# EAGLE design Microcontroller_With_Power_Supply_Module_Project (EAGLE 9.6.2)
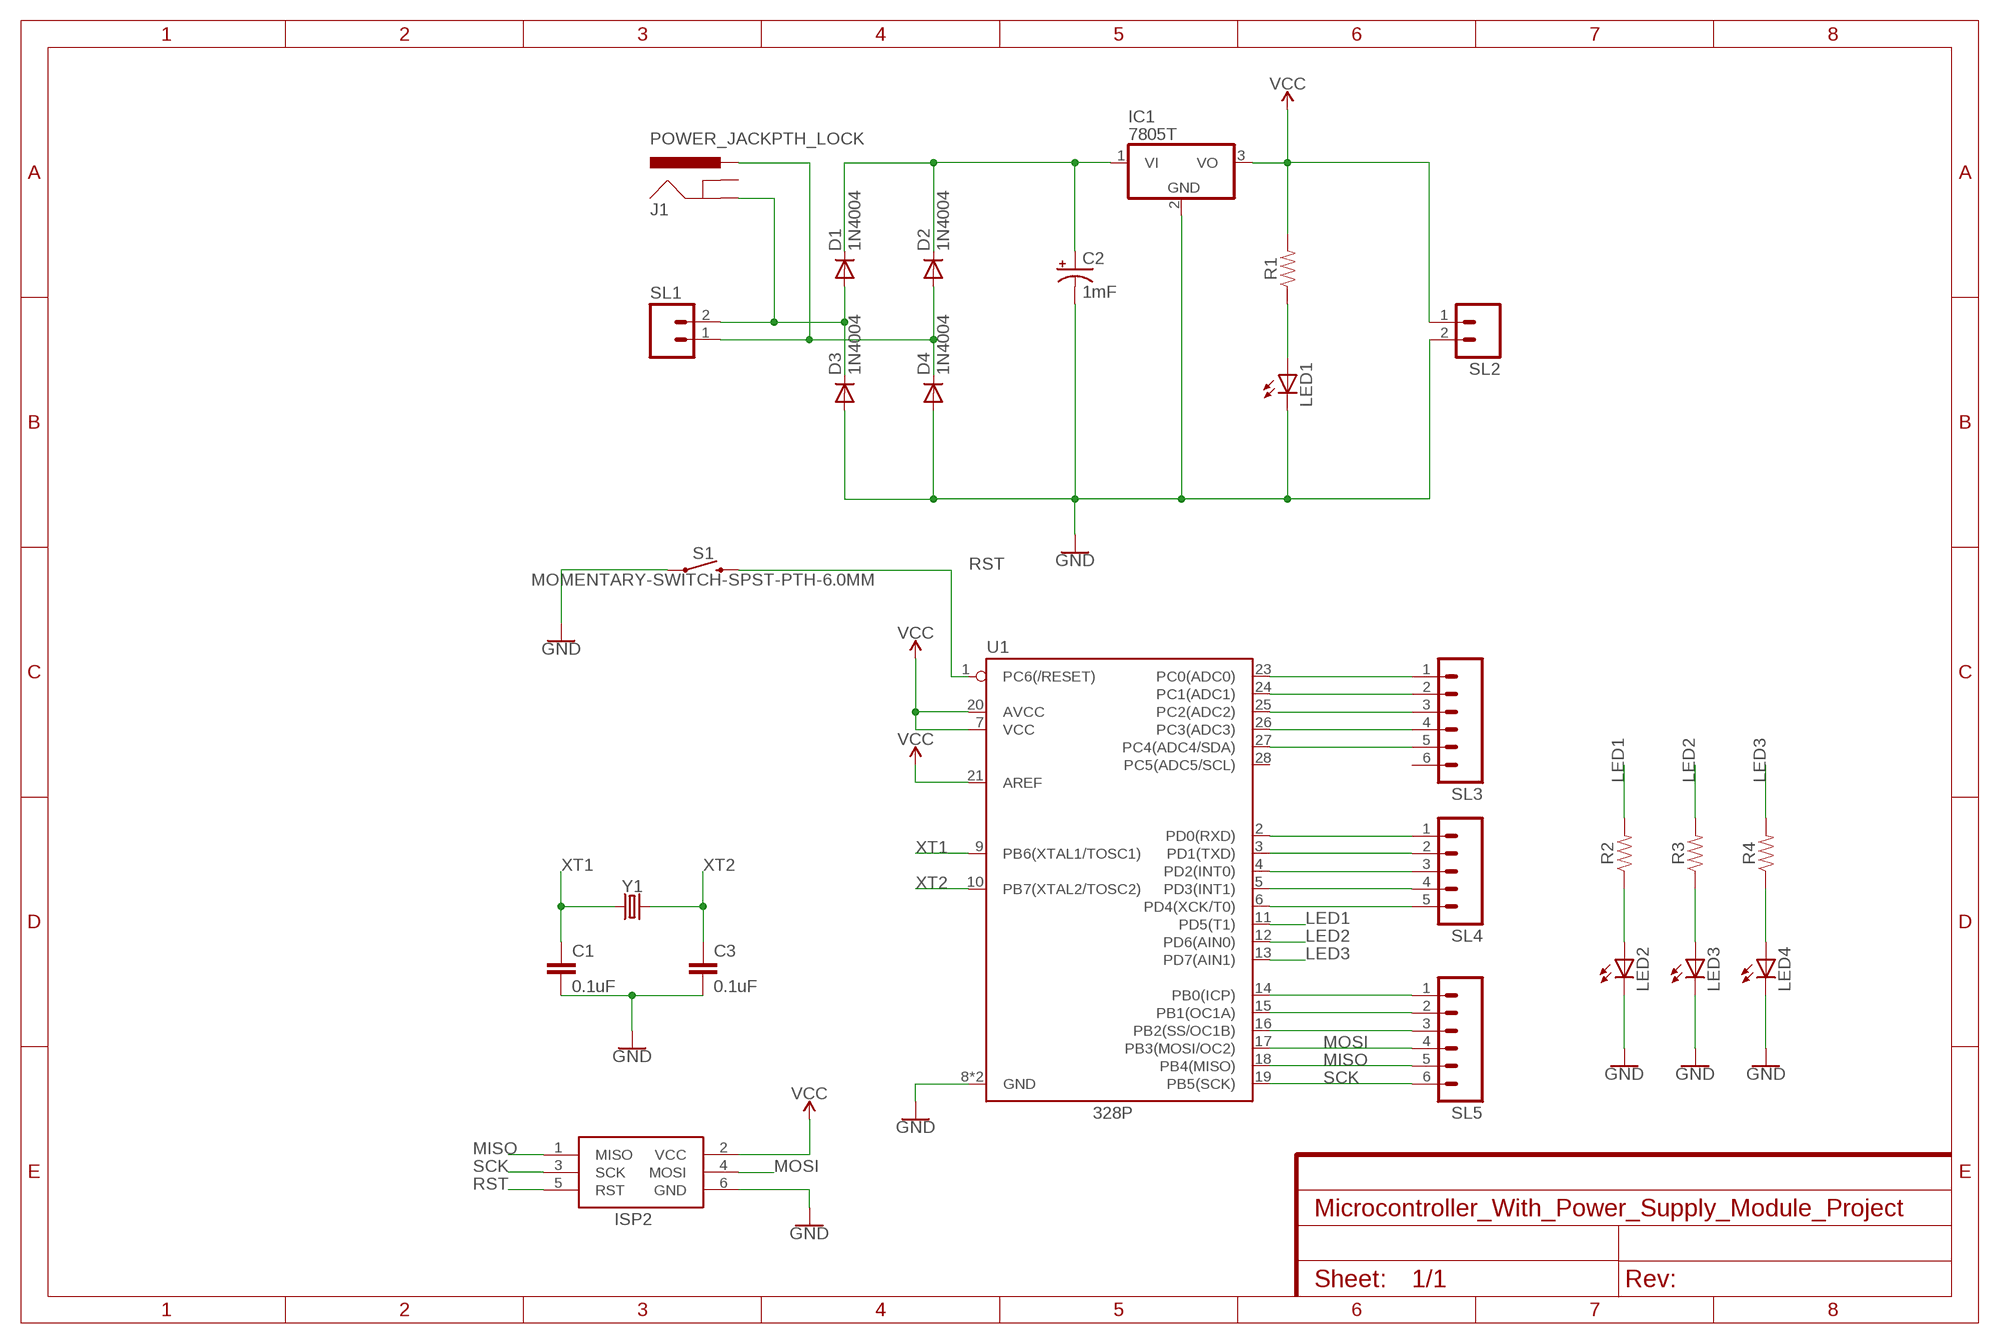
[diagram p0: schematic, sheet 1]

## Parts
C1  0.1uF  0.1UF-KIT-EZ-50V-20%  [CAP-PTH-SMALL-KIT]
C2  1mF  1000UF-RADIAL-5MM-25V-20%  [CPOL-RADIAL-5MM-10MM]
C3  0.1uF  0.1UF-KIT-EZ-50V-20%  [CAP-PTH-SMALL-KIT]
D1  1N4004  [DO41-10]
D2  1N4004  [DO41-10]
D3  1N4004  [DO41-10]
D4  1N4004  [DO41-10]
IC1  7805T  [TO220H]
ISP2  AVRISP-6  [AVRISP]
J1  POWER_JACKPTH_LOCK  [POWER_JACK_PTH_LOCK]
LED1  LED5MM  [LED5MM]
LED2  LED3MM  [LED3MM]
LED3  LED3MM  [LED3MM]
LED4  LED3MM  [LED3MM]
R1  RESISTORAXIAL-0.3  [AXIAL-0.3]
R2  RESISTORAXIAL-0.3  [AXIAL-0.3]
R3  RESISTORAXIAL-0.3  [AXIAL-0.3]
R4  RESISTORAXIAL-0.3  [AXIAL-0.3]
S1  MOMENTARY-SWITCH-SPST-PTH-6.0MM  [TACTILE_SWITCH_PTH_6.0MM]
SL1  M02  [02P]
SL2  M02  [02P]
SL3  M06  [06P]
SL4  M05  [05P]
SL5  M06  [06P]
U1  328P  ATMEGA328P_PDIP  [DIP28]
Y1  CRYSTALPTH-HC49US  [HC49US]

## Nets
GND: C1.2 C2.- C3.2 D3.A D4.A IC1.2(GND) ISP2.6(GND) LED1.K(C) LED2.K(C) LED3.K(C) LED4.K(C) S1.1 SL2.2 U1.8(GND) U1.22(GND)
LED1: R2.P$2 U1.11(PD5(T1))
LED2: R3.P$2 U1.12(PD6(AIN0))
LED3: R4.P$2 U1.13(PD7(AIN1))
MISO: ISP2.1(MISO) SL5.5 U1.18(PB4(MISO))
MOSI: ISP2.4(MOSI) SL5.4 U1.17(PB3(MOSI/OC2))
N$1: D1.A D3.C J1.GND SL1.2
N$2: D2.A D4.C J1.PWR SL1.1
N$3: C2.+ D1.C D2.C IC1.1(VI)
N$5: LED4.A R4.P$1
N$6: LED1.A R1.P$1
N$7: LED3.A R3.P$1
N$8: LED2.A R2.P$1
N$9: SL3.1 U1.23(PC0(ADC0))
N$10: SL3.2 U1.24(PC1(ADC1))
N$11: SL3.3 U1.25(PC2(ADC2))
N$12: SL3.4 U1.26(PC3(ADC3))
N$13: SL3.5 U1.27(PC4(ADC4/SDA))
N$14: SL4.1 U1.2(PD0(RXD))
N$15: SL4.2 U1.3(PD1(TXD))
N$16: SL4.3 U1.4(PD2(INT0))
N$17: SL4.4 U1.5(PD3(INT1))
N$18: SL4.5 U1.6(PD4(XCK/T0))
N$19: SL5.1 U1.14(PB0(ICP))
N$20: SL5.2 U1.15(PB1(OC1A))
N$21: SL5.3 U1.16(PB2(SS/OC1B))
RST: ISP2.5(RST) S1.3 U1.1(PC6(/RESET))
SCK: ISP2.3(SCK) SL5.6 U1.19(PB5(SCK))
VCC: IC1.3(VO) ISP2.2(VCC) R1.P$2 SL2.1 U1.7(VCC) U1.20(AVCC) U1.21(AREF)
XT1: C1.1 U1.9(PB6(XTAL1/TOSC1)) Y1.1
XT2: C3.1 U1.10(PB7(XTAL2/TOSC2)) Y1.2
Unconnected: J1.GNDBREAK SL3.6 U1.28(PC5(ADC5/SCL))

## Library data of the parts
C1 C3 = SparkFun-Capacitors:0.1UF: 0.1µF ceramic capacitors A capacitor is a passive two-terminal electrical component used to store electrical energy temporarily in an electric field.; PROD_ID: CAP-08370
C2 = SparkFun-Capacitors:1000UF: 1,000µF/1mF ceramic capacitors A capacitor is a passive two-terminal electrical component used to store electrical energy temporarily in an electric field. CAP-08070; PROD_ID: CAP-09538
D1-D4 = adafruit:1N4004: DIODE General purpose 1N400x type rectifier (With bigger pads) http://www.ladyada.net/library/pcb/eaglelibrary.html
IC1 = adafruit:78*: Positive VOLTAGE REGULATOR Added bigger pads to the TO-92 package
ISP2 = adafruit:AVRISP: AVR ISP HEADER Standard 6 pin header for AVR programming
J1 = SparkFun-Connectors:POWER_JACK: Power Jack Connector This is the standard 5.5mm barrel jack for power. The PTH is the most common, proven, reliable, footprint. The Slot footprint only works if the mill layer is transmitted to the PCB fab house so be warned. Here are the connectors we sell at SparkFun: DC Barrel Power Jack/Connector <https://www.sparkfun.com/products/119> (PRT-00119) DC Barrel Power Jack/Connector (SMD) <https://www.sparkfun.com/products/12748> (PRT-12748) DC Barrel Jack Adapter - Breadboard Compatible <https://www.sparkfun.com/products/10811> (PRT-10811) It is used on this SparkFun product (and many, many others): SparkFun RedBoard - Programmed with Arduino <https://www.sparkfun.com/products/12757> (DEV-12757) Also, if you need a mating power supply or connector, please check these out: Wall Adapter Power Supply - 9VDC 650mA <https://www.sparkfun.com/products/298> (TOL-00298) DC Barrel Jack Adapter - Male <https://www.sparkfun.com/products/10287> (PRT-10287); PROD_ID: CONN-08197; SF_ID: PRT-00119
LED1-LED4 = adafruit:LED: LED OSRAM: - CHIPLED LG R971, LG N971, LY N971, LG Q971, LY Q971, LO R971, LY R971 LH N974, LH R974 LS Q976, LO Q976, LY Q976 LO Q996 - Hyper CHIPLED LW Q18S LB Q993, LB Q99A, LB R99A - SideLED LS A670, LO A670, LY A670, LG A670, LP A670 LB A673, LV A673, LT A673, LW A673 LH A674 LY A675 LS A676, LA A676, LO A676, LY A676, LW A676 LS A679, LY A679, LG A679 - Hyper Micro SIDELED® LS Y876, LA Y876, LO Y876, LY Y876 LT Y87S - SmartLED LW L88C, LW L88S LB L89C, LB L89S, LG L890 LS L89K, LO L89K, LY L89K LS L896, LA L896, LO L896, LY L896 - TOPLED LS T670, LO T670, LY T670, LG T670, LP T670 LSG T670, LSP T670, LSY T670, LOP T670, LYG T670 LG T671, LOG T671, LSG T671 LB T673, LV T673, LT T673, LW T673 LH T674 LS T676, LA T676, LO T676, LY T676, LB T676, LH T676, LSB T676, LW T676 LB T67C, LV T67C, LT T67C, LS T67K, LO T67K, LY T67K, LW E67C LS E67B, LA E67B, LO E67B, LY E67B, LB E67C, LV E67C, LT E67C LW T67C LS T679, LY T679, LG T679 LS T770, LO T770, LY T770, LG T770, LP T770 LB T773, LV T773, LT T773, LW T773 LH T774 LS E675, LA E675, LY E675, LS T675 LS T776, LA T776, LO T776, LY T776, LB T776 LHGB T686 LT T68C, LB T68C - Hyper Mini TOPLED® LB M676 - Mini TOPLED Santana® LG M470 LS M47K, LO M47K, LY M47K Source: http://www.osram.convergy.de/
R1-R4 = SparkFun-Resistors:RESISTOR: Generic Resistor Package
S1 = SparkFun-Switches:MOMENTARY-SWITCH-SPST: Momentary Switch (Pushbutton) - SPST Normally-open (NO) SPST momentary switches (buttons, pushbuttons). Variants PTH-12MM - 12mm square, through-hole Momentary Pushbutton Switch - 12mm Square <https://www.sparkfun.com/products/9190> (COM-09190) PTH-6.0MM, PTH-6.0MM-KIT - 6.0mm square, through-hole Mini Pushbutton Switch <https://www.sparkfun.com/products/97> (COM-00097) KIT package intended for soldering kit's - only one side of pads' copper is exposed. PTH-RIGHT-ANGLE-KIT - Right-angle, through-hole Right Angle Tactile Button <https://www.sparkfun.com/products/10791> - Used on SparkFun BigTime Watch Kit <https://www.sparkfun.com/products/11734> SMD-12MM - 12mm square, surface-mount Tactile Button - SMD (12mm) <https://www.sparkfun.com/products/12993> (COM-12993) Used on SparkFun PicoBoard <https://www.sparkfun.com/products/11888> SMD-4.5MM - 4.5mm Square Trackball Switch Used on SparkFun Blackberry Trackballer Breakout <https://www.sparkfun.com/products/13169> SMD-4.6MMX2.8MM - 4.60mm x 2.80mm, surface mount Used on SparkFun Pro Micro - RP2040 <https://www.sparkfun.com/products/17717> SMD-5.2MM, SMD-5.2-REDUNDANT - 5.2mm square, surface-mount Mini Pushbutton Switch - SMD <https://www.sparkfun.com/products/8720> (COM-08720) Used on Arduino Pro Mini <https://www.sparkfun.com/products/11114> REDUNDANT package connects both switch circuits together SMD-6.0X3.5MM - 6.0 x 3.5mm, surface mount Momentary Reset Switch SMD <https://www.sparkfun.com/products/8229> (COM-08229) SMD-6.2MM-TALL - 6.2mm square, surface mount Tactile Button - SMD (6mm) <https://www.sparkfun.com/products/12992> Used on SparkFun Digital Sandbox <https://www.sparkfun.com/products/12651> SMD-RIGHT-ANGLE - Right-angle, surface mount Used on SparkFun Block for Intel® Edison - Arduino <https://www.sparkfun.com/products/13036>; PROD_ID: SWCH-08441; SF_SKU: COM-00097
SL1 SL2 = con-amp-quick:M02: AMP QUICK CONNECTOR; OC_FARNELL: unknown; OC_NEWARK: unknown
SL3 SL5 = con-amp-quick:M06: AMP QUICK CONNECTOR; OC_FARNELL: unknown; OC_NEWARK: unknown
SL4 = con-amp-quick:M05: AMP QUICK CONNECTOR; OC_FARNELL: unknown; OC_NEWARK: unknown
U1 = SparkFun-IC-Microcontroller:ATMEGA328P_PDIP: Atmel 328P Through hole ATMEGA328P uC used in the Arduino 32kb flash, 1k EEPROM, 2k SRAM Datasheet <http://www.sparkfun.com/datasheets/Components/SMD/ATMega328.pdf> SparkFun Products Storefront component: AVR 28 Pin 20MHz 32K 6A/D - ATMega328P <https://www.sparkfun.com/products/9061> (COM-09061) SparkFun Simon Says - Through-Hole Soldering Kit <https://www.sparkfun.com/products/10547> (KIT-10547) SparkFun Learn to Solder - Simon Says <https://www.sparkfun.com/products/13708> (KIT-13708) SparkFun BigTime Watch Kit <https://www.sparkfun.com/products/11734> (KIT-11734) SparkFun ClockIt <https://www.sparkfun.com/products/10930> (KIT-10930) SparkFun Serial Enabled LCD Kit <https://www.sparkfun.com/products/10097> (LCD-10097) SparkFun Simon Tilts - Through Hole Soldering Kit <https://www.sparkfun.com/products/12634> (KIT-12634) SparkFun Frequency Counter Kit <https://www.sparkfun.com/products/10140> (KIT-10140) FabFM Radio Kit <https://www.sparkfun.com/products/11043> (KIT-11043) SparkFun Binary Blaster Kit <https://www.sparkfun.com/products/12037> (KIT-12037) SparkFun Metro-Gnome <https://www.sparkfun.com/products/9236> (KIT-09236) ATmega328 with Arduino Optiboot (Uno) <https://www.sparkfun.com/products/10524> (DEV-10524); PROD_ID: IC-09136
Y1 = SparkFun-Clocks:CRYSTAL: Crystals (Generic) These are passive quartz crystals, which can be used as a clock source for a microcontroller. Crystal's are two-terminal devices. They require external "load" capacitors to generate an oscillating signal.

## Board
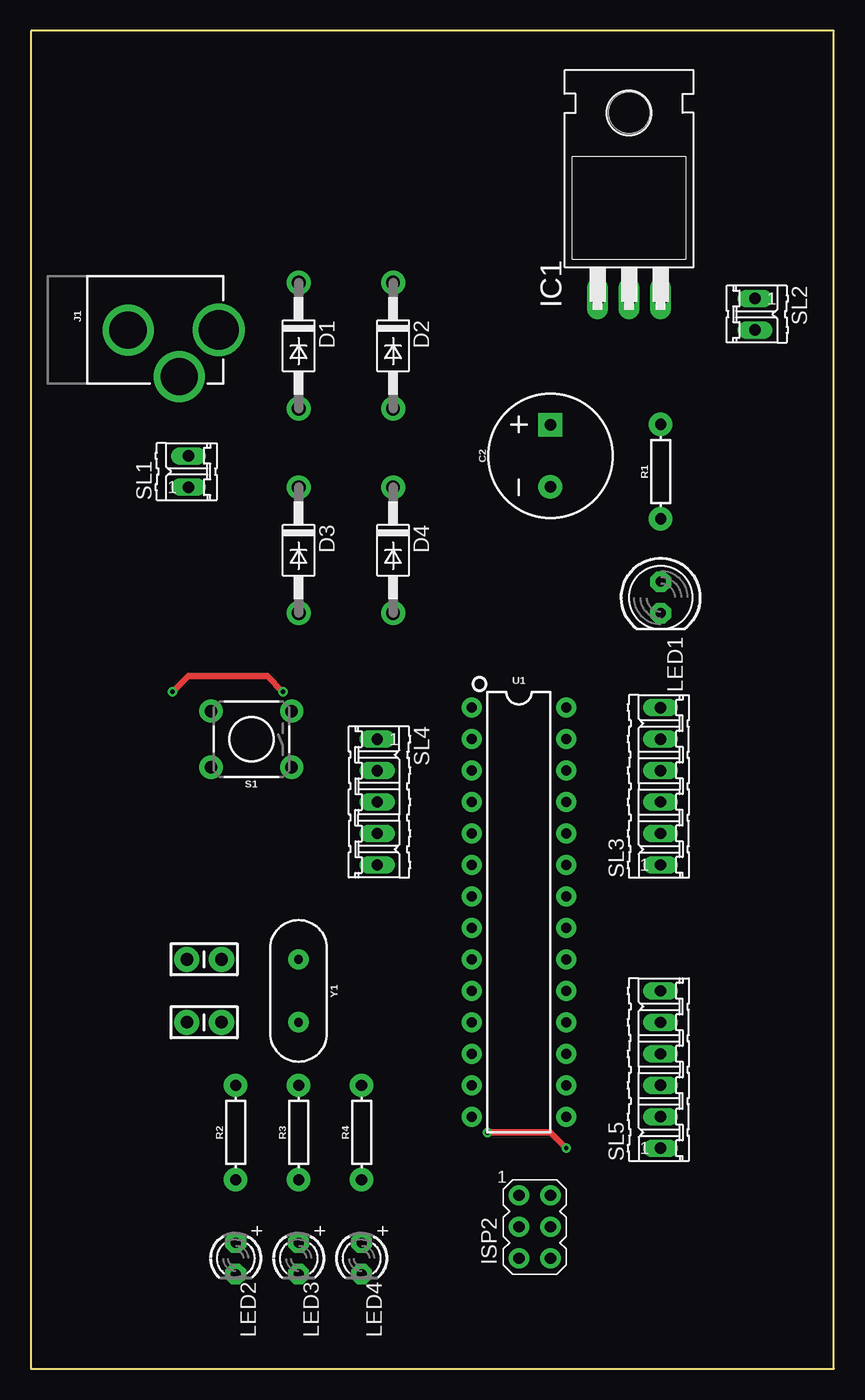
[diagram p1: board, top side]
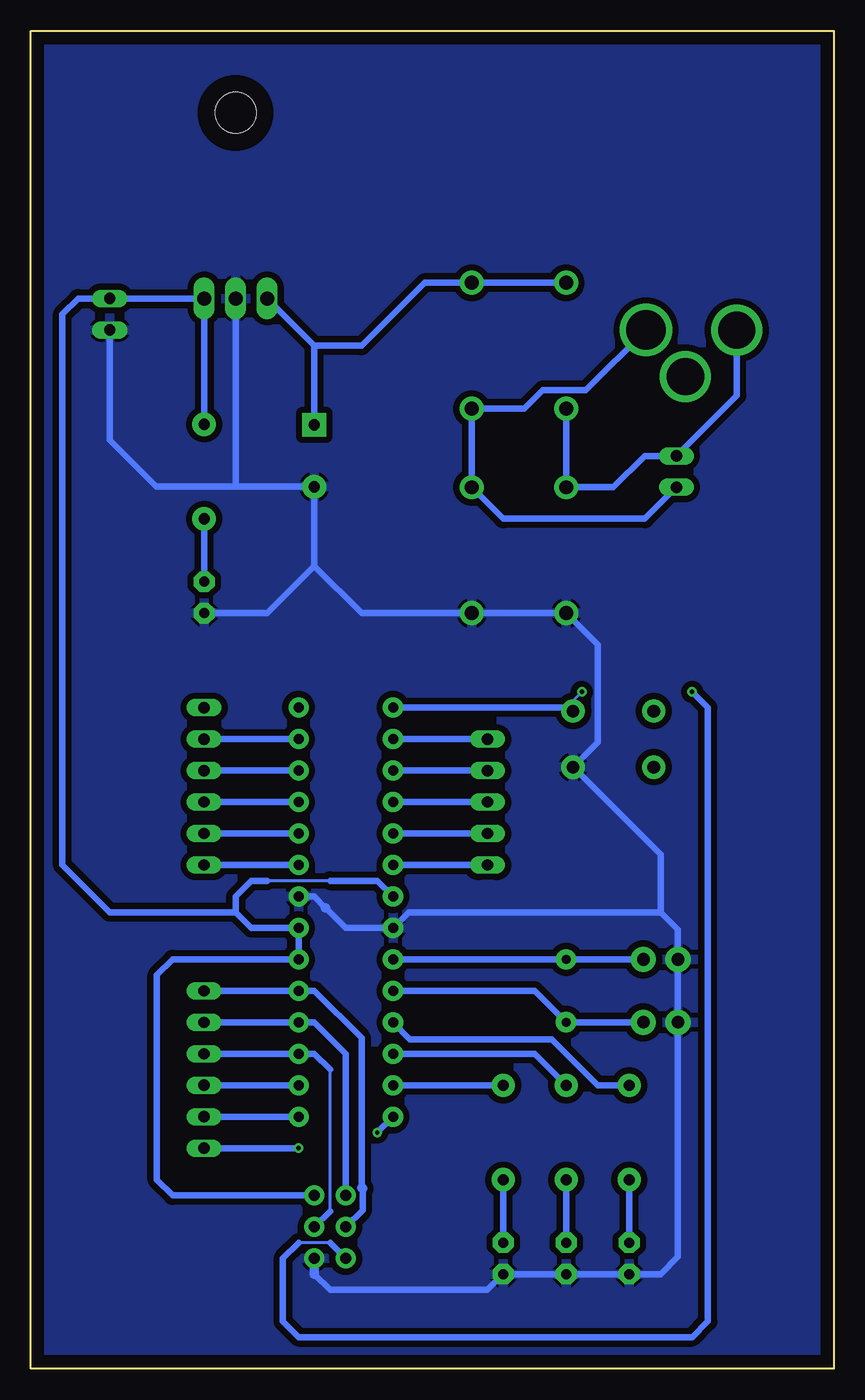
[diagram p2: board, bottom side, seen from below]

Size 64.77 x 107.95 mm. Coordinates in mm from the lower left corner, seen from the top.
Outline: 64.77,107.95 0,107.95 0,0 64.77,0 64.77,107.95
Copper layers (1*16): Top 0.035mm / dielectric 1.5mm / Bottom 0.035mm
Design rules "default": minimum track width 6mil, minimum drill 0.35mm, track to track 6mil, track to pad 6mil, pad to pad 6mil, via to via 6mil, smd to smd 6mil, copper to edge 40mil, drill to drill 6mil, minimum pad ring 10mil, minimum via ring 8mil, stop-mask expansion 4mil, vias tented up to drill 0mil, thermal gap 10mil

### Footprints (pad centres in the part's own frame; a part is rotated, then mirrored left to right if it is on the bottom)
CAP-PTH-SMALL-KIT = drill 1.016 pad 2.032: 1 -1.397,0; 2 1.397,0
CPOL-RADIAL-5MM-10MM = drill 0.9 pad 1.93 square: + 2.5,0 | drill 0.9 pad 1.93: - -2.5,0
DO41-10 = drill 1.118 pad 1.93: A 5.08,0; C -5.08,0
TO220H = drill 1.118 long: 1 -2.54,-10.16; 2 0,-10.16; 3 2.54,-10.16 | hole 3.302: 0,4.826
AVRISP = drill 0.9 pad 1.626: 1 -1.27,2.54; 2 1.27,2.54; 3 -1.27,0; 4 1.27,0; 5 -1.27,-2.54; 6 1.27,-2.54
POWER_JACK_PTH_LOCK = drill 2.997 pad 4.115: GND 0.025,6.557; GNDBREAK 3.762,10.7 | drill 3.2 pad 4.115: PWR 0,13.878
LED5MM = drill 0.813 pad 1.676 octagon: A -1.27,0; K 1.27,0
LED3MM = drill 0.813 pad 1.676 octagon: A -1.27,0; K 1.27,0
AXIAL-0.3 = drill 0.9 pad 1.88: P$1 -3.81,0; P$2 3.81,0
TACTILE_SWITCH_PTH_6.0MM = drill 1.016 pad 1.88: 1 -3.251,2.261; 2 3.251,2.261; 3 -3.251,-2.261; 4 3.251,-2.261
02P = drill 0.914 long: 1 -1.27,0; 2 1.27,0
06P = drill 0.914 long: 1 -6.35,0; 2 -3.81,0; 3 -1.27,0; 4 1.27,0; 5 3.81,0; 6 6.35,0
05P = drill 0.914 long: 1 -5.08,0; 2 -2.54,0; 3 0,0; 4 2.54,0; 5 5.08,0
DIP28 = drill 0.813 pad 1.626: 1 -16.51,-3.81; 2 -13.97,-3.81; 3 -11.43,-3.81; 4 -8.89,-3.81; 5 -6.35,-3.81; 6 -3.81,-3.81; 7 -1.27,-3.81; 8 1.27,-3.81; 9 3.81,-3.81; 10 6.35,-3.81; 11 8.89,-3.81; 12 11.43,-3.81; 13 13.97,-3.81; 14 16.51,-3.81; 15 16.51,3.81; 16 13.97,3.81; 17 11.43,3.81; 18 8.89,3.81; 19 6.35,3.81; 20 3.81,3.81; 21 1.27,3.81; 22 -1.27,3.81; 23 -3.81,3.81; 24 -6.35,3.81; 25 -8.89,3.81; 26 -11.43,3.81; 27 -13.97,3.81; 28 -16.51,3.81
HC49US = drill 0.7 pad 1.651: 1 -2.54,0; 2 2.54,0

### Placement (x,y rotation side)
C1  13.97,33.02 180 top
C2  41.91,73.66 90 top
C3  13.97,27.94 180 top
D1  21.59,82.55 270 top
D2  29.21,82.55 270 top
D3  21.59,66.04 270 top
D4  29.21,66.04 270 top
IC1  48.26,96.52 0 top
ISP2  40.64,11.43 0 top
J1  1.27,83.82 270 top
LED1  50.8,62.23 270 top
LED2  16.51,8.89 270 top
LED3  21.59,8.89 270 top
LED4  26.67,8.89 270 top
R1  50.8,72.39 90 top
R2  16.51,19.05 90 top
R3  21.59,19.05 90 top
R4  26.67,19.05 90 top
S1  17.78,50.8 180 top
SL1  12.7,72.39 90 top
SL2  58.42,85.09 270 top
SL3  50.8,46.99 90 top
SL4  27.94,45.72 270 top
SL5  50.8,24.13 90 top
U1  39.37,36.83 270 top
Y1  21.59,30.48 270 top

### Tracks (layer width: path | path; a pad name or v marks a point on that pad's centre or on a via)
GND
  Bottom 0.508: 48.26,71.16 C2.- 41.91,64.77 | 48.26,71.16 54.65,71.16 58.42,74.93 SL2.2 | IC1.2 48.26,71.16 | LED1.K 45.72,60.96 41.91,64.77 | 41.91,64.77 38.1,60.96 D4.A D3.A 19.05,58.42 19.05,50.52 S1.1 13.97,41.48 13.97,36.83 | 41.91,7.62 40.64,6.35 27.94,6.35 LED4.K LED3.K LED2.K 13.97,7.62 12.57,9.02 C3.2 C1.2 12.57,35.43 13.97,36.83 | 41.02,37.19 41.93,38.1 U1.22 | 41,37.19 39.37,35.56 U1.8 34.29,36.83 13.97,36.83
  Bottom 0.762: ISP2.6 41.91,7.62 | 41,37.19 41.02,37.19
  pour Bottom (isolate 0.508): 0,0 64.77,0 64.77,107.95 0,107.95
LED1
  Bottom 0.508: R2.P$2 19.05,22.86 22.77,26.58 34.2,26.58 U1.11
LED2
  Bottom 0.508: R3.P$2 24.13,25.4 U1.12
LED3
  Bottom 0.508: R4.P$2 U1.13
MISO
  Bottom 0.508: ISP2.1 39.37,25.4 41.91,27.94 U1.18 SL5.5
MOSI
  Bottom 0.254: 40.64,12.7 40.64,24.13
  Bottom 0.508: ISP2.4 40.64,12.7 | 40.64,24.13 41.91,25.4 U1.17 SL5.4
N$1
  Bottom 0.508: D1.A D3.C 17.78,71.12 15.24,73.66 SL1.2 10.16,76.2 7.83,78.53 J1.GND
N$2
  Bottom 0.508: SL1.1 15.24,68.58 26.67,68.58 D4.C D2.A 24.98,77.47 23.48,78.97 20,78.97 J1.PWR
N$3
  Bottom 0.508: C2.+ 41.91,82.55 | 41.91,82.55 IC1.1 | D1.C D2.C 33.02,87.63 38.1,82.55 41.91,82.55
N$5
  Bottom 0.508: LED4.A R4.P$1
N$6
  Bottom 0.508: LED1.A R1.P$1
N$7
  Bottom 0.508: LED3.A R3.P$1
N$8
  Bottom 0.508: LED2.A R2.P$1
N$9
  Bottom 0.508: U1.23 SL3.1
N$10
  Bottom 0.508: U1.24 SL3.2
N$11
  Bottom 0.508: U1.25 SL3.3
N$12
  Bottom 0.508: U1.26 SL3.4
N$13
  Bottom 0.508: U1.27 SL3.5
N$14
  Bottom 0.508: SL4.1 U1.2
N$15
  Bottom 0.508: SL4.2 U1.3
N$16
  Bottom 0.508: SL4.3 U1.4
N$17
  Bottom 0.508: SL4.4 U1.5
N$18
  Bottom 0.508: SL4.5 U1.6
N$19  (via drill 0.35)
  Top 0.508: v36.83,19.05 41.91,19.05 v43.18,17.78
  Bottom 0.508: U1.14 v36.83,19.05 | v43.18,17.78 SL5.1
N$20
  Bottom 0.508: U1.15 SL5.2
N$21
  Bottom 0.508: U1.16 SL5.3
RST  (via drill 0.35)
  Top 0.508: v20.32,54.61 19.05,55.88 12.7,55.88 v11.43,54.61
  Bottom 0.254: v20.32,54.61 21.03,53.9 S1.3 | 40.64,10.16 43.18,10.16
  Bottom 0.508: 21.31,53.34 U1.1 | ISP2.5 40.64,10.16 | 43.18,10.16 44.45,8.89 44.45,3.81 43.18,2.54 11.43,2.54 10.16,3.81 10.16,53.34 v11.43,54.61
  Bottom 0.762: S1.3 21.31,53.34
SCK
  Bottom 0.508: SL5.6 U1.19 41.91,30.48 38.1,26.67 38.1,14.6 | ISP2.3 38.02,12.78 38.02,14.53
  Bottom 0.762: 38.02,14.53 38.1,14.6
VCC
  Bottom 0.254: 40.64,39.37 45.72,39.37
  Bottom 0.508: R1.P$2 IC1.3 SL2.1 60.96,86.36 62.23,85.09 62.23,40.64 58.42,36.83 48.26,36.83 | ISP2.2 53.34,13.97 54.61,15.24 54.61,31.75 53.34,33.02 U1.20 U1.21 46.99,35.56 48.26,36.83 | 40.64,39.37 36.83,39.37 U1.7 | 45.72,39.37 46.99,39.37 48.26,38.1 48.26,36.83
XT1
  Bottom 0.508: U1.9 Y1.1 C1.1
XT2
  Bottom 0.508: U1.10 24.13,30.48 Y1.2 C3.1